# Altium schematic sheet [08]-PumpDriverUnit.SchDoc: RS232 and RS422/RS485 (part 1 of 3)
size A3; Organization: Toradex AG; Address1: Altsagenstrasse 5; Address2: Horw; Address3: 6048; Address4: Switzerland; DocumentNumber: 8; Revision: V3.2; SheetNumber: 8; SheetTotal: 26; PageSetup: Record=PageOptions|CenterHorizontal=True|CenterVertical=True|PrintScale=0.73|XCorrection=1.00|YCorrection=1.00|PrintKind=0|BorderSize=5000000|LeftOffset=0|BottomOffset=0|Orientation=2|PaperLength=1000|PaperWidth=1000|Scale=100|PaperSource=7|PrintQuality=-4|MediaType=1|DitherType=10|PaperKind=A4|PrintScaleMode=1
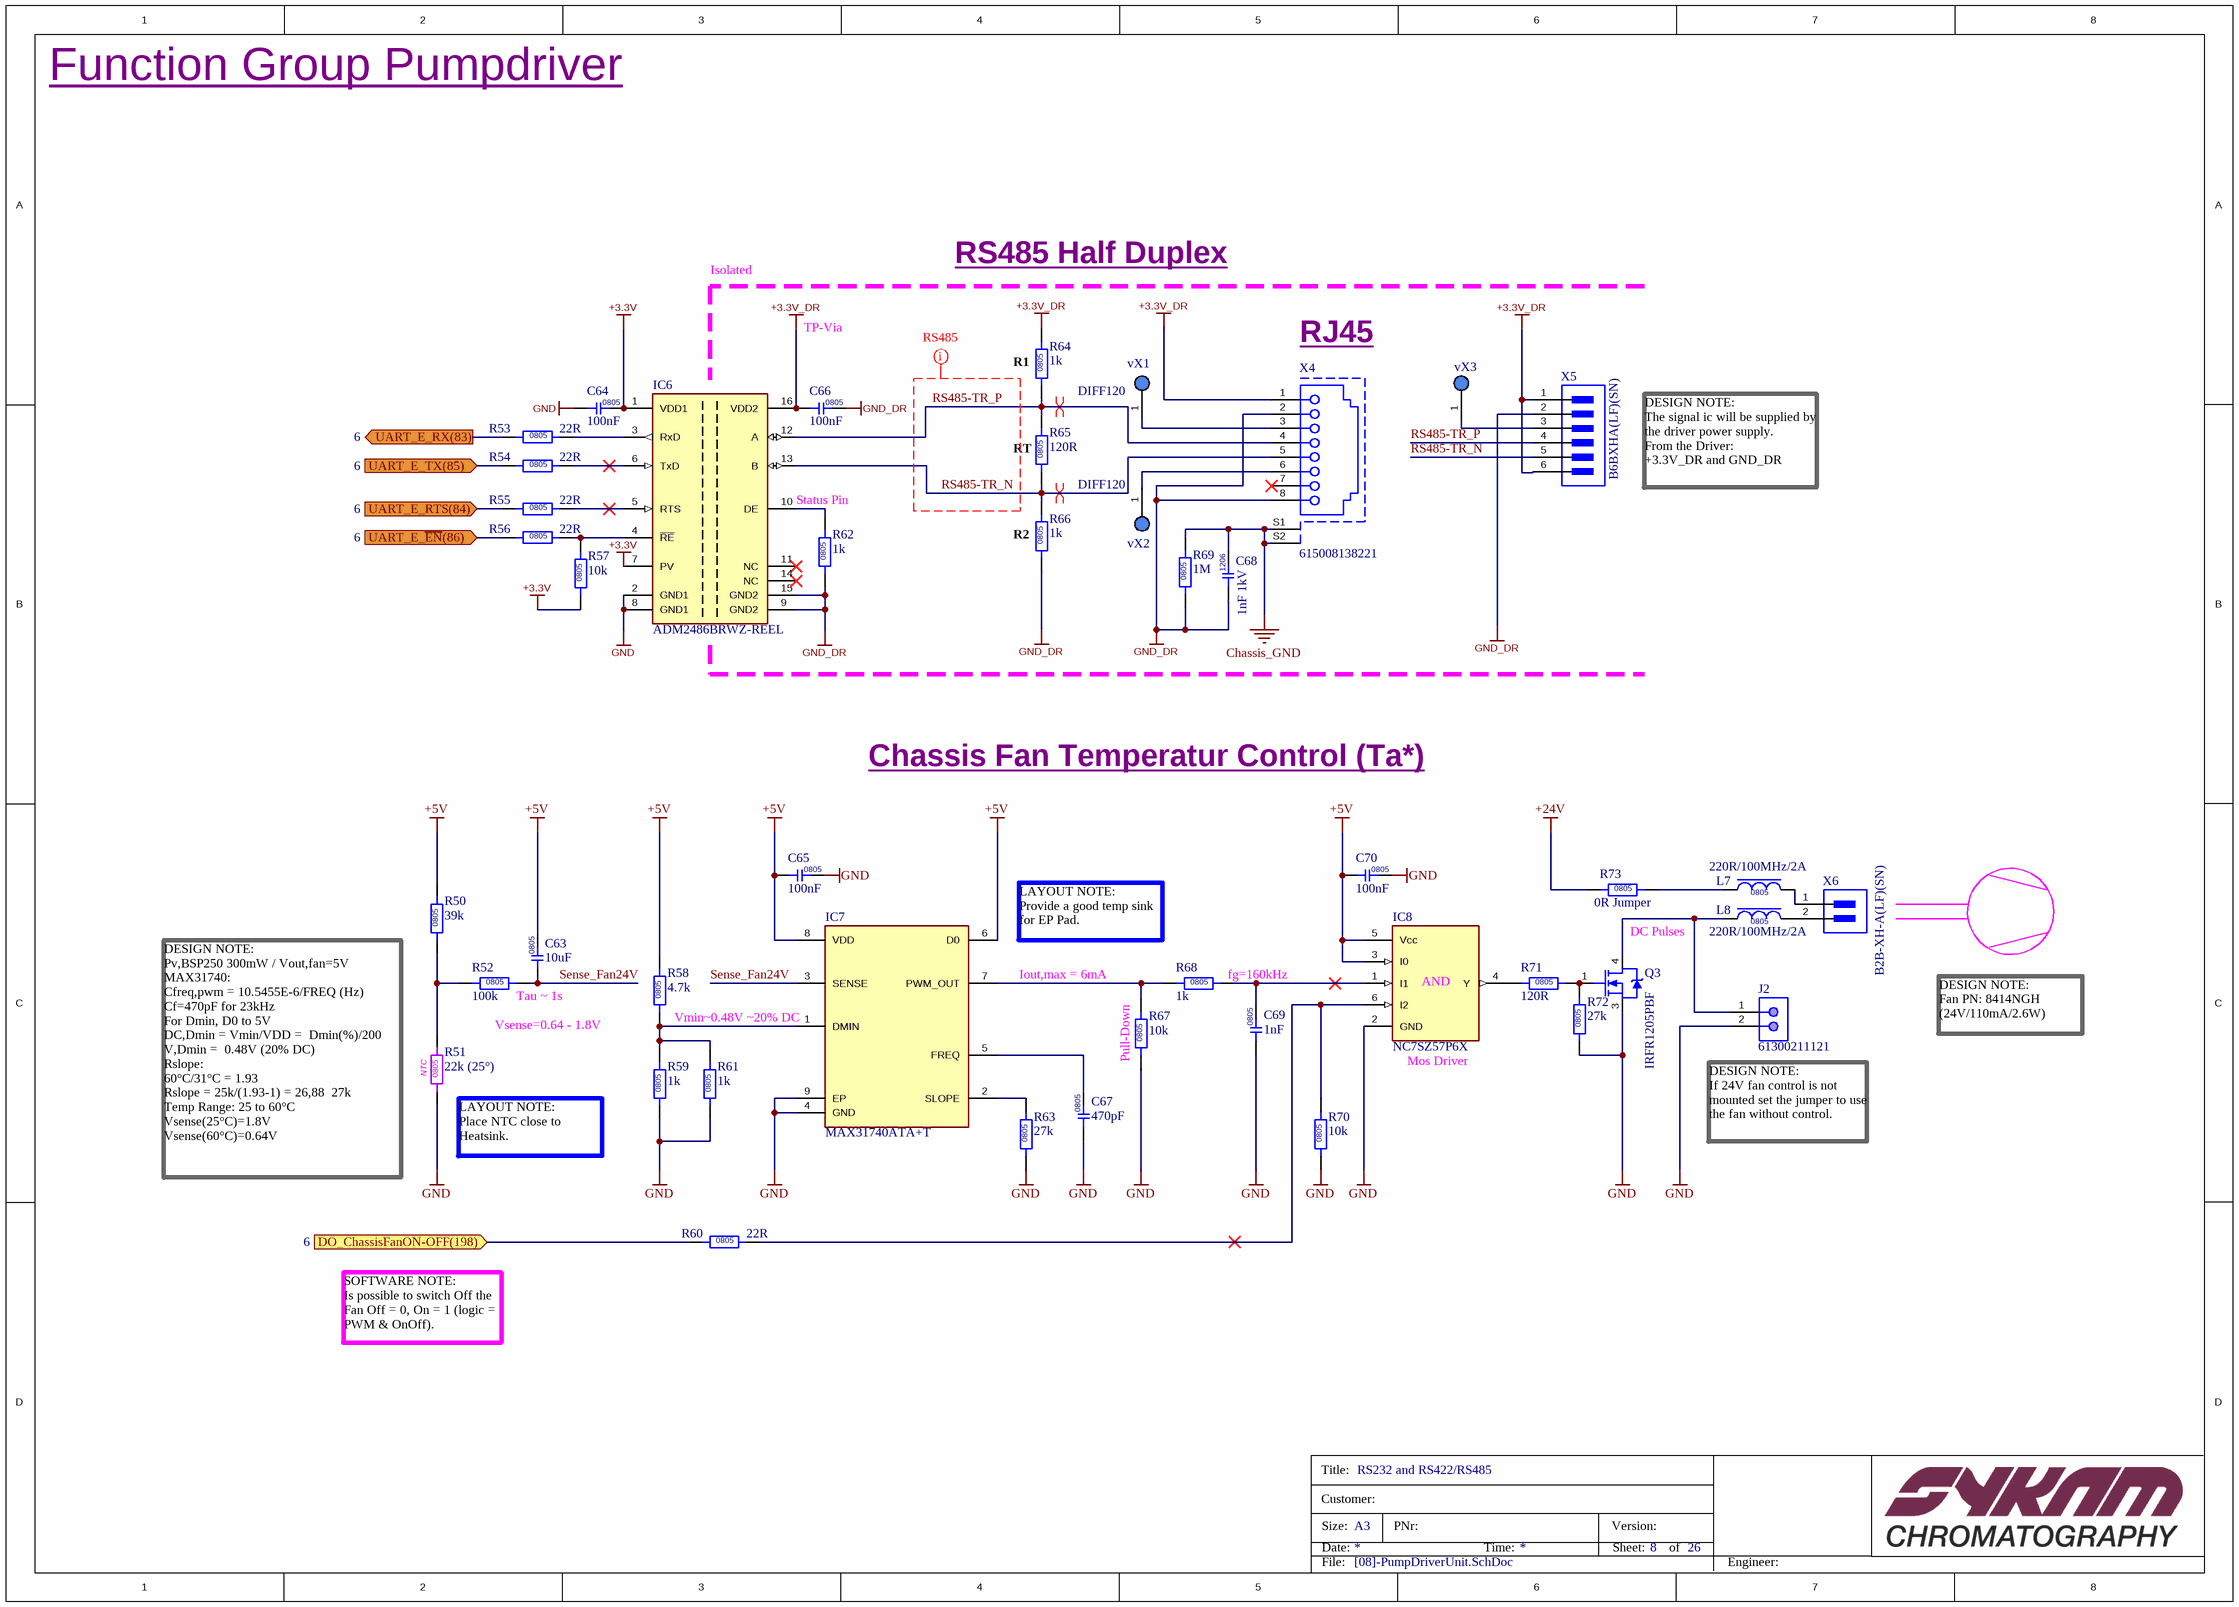
[diagram p0: [08]-PumpDriverUnit.SchDoc]

## Parts
C63  10uF  [C0805]
C64  100nF  [C0805]
C65  100nF  [C0805]
C66  100nF  [C0805]
C67  470pF  [C0805]
C68  1nF 1kV  [C1206]
C69  1nF  [C0805]
C70  100nF  [C0805]
IC6  ADM2486BRWZ-REEL  [ADM2486_SOIC16W]
IC7  MAX31740ATA+T  [TDFN-MN8]
IC8  NC7SZ57P6X  [NC7SZ57P6X]
J2  61300211121  [CON-61300211121_Jumper-2p]
L7  220R/100MHz/2A  [L0805]
L8  220R/100MHz/2A  [L0805]
Q3  IRFR1205PBF  [NMOS-TO-252AA-3_M]
R50  39k  [R0805]
R51  22k (25°)  [R_NTC-PTC-0805]
R52  100k  [R0805]
R53  22R  [R0805]
R54  22R  [R0805]
R55  22R  [R0805]
R56  22R  [R0805]
R57  10k  [R0805]
R58  4.7k  [R0805]
R59  1k  [R0805]
R60  22R  [R0805]
R61  1k  [R0805]
R62  1k  [R0805]
R63  27k  [R0805]
R64  1k  [R0805]
R65  120R  [R0805]
R66  1k  [R0805]
R67  10k  [R0805]
R68  1k  [R0805]
R69  1M  [R0805]
R70  10k  [R0805]
R71  120R  [R0805]
R72  27k  [R0805]
R73  0R Jumper  [R0805]
vX1  Reserve Contact Via 0.5mm  [ReseveContact]  (value not drawn)  (no BOM)
vX2  Reserve Contact Via 0.5mm  [ReseveContact]  (value not drawn)  (no BOM)
vX3  Reserve Contact Via 0.5mm  [ReseveContact]  (value not drawn)  (no BOM)
X4  615008138221  [RJ45-V-615008138221]
X5  B6BXHA(LF)(SN)  [B6BXHA(LF)(SN)]
X6  B2B-XH-A(LF)(SN)  [CON_2p_JST-B2B-XH-A_V]

## Ports
DO_ChassisFanON-OFF(198) (in, see 6), UART_E_RTS(84) (in, see 6), UART_E_RX(83) (out, see 6), UART_E_TX(85) (in, see 6), UART_E_~{EN}(86) (in, see 6)

## Nets
+3.3V: C64.2 IC6.1(VDD1) IC6.7(PV) R57.1
+3.3V_DR: C66.1 IC6.16(VDD2) R64.2 X4.1 X5.1 X5.6
+5V: C63.2 C65.1 C70.1 IC7.6(D0) IC7.8(VDD) IC8.3(I0) IC8.5(Vcc) R50.2 R58.2
+24V: R73.1
Chassis_GND: C68.2 R69.2 X4.S1 X4.S2
GND: C64.1 C65.2 C67.1 C69.1 C70.2 IC6.2(GND1) IC6.8(GND1) IC7.4(GND) IC7.9(EP) IC8.2(GND) J2.2 Q3.3(S) R51.1 R59.1 R61.1 R63.1 R67.1 R70.1 R72.1
GND_DR: C66.2 C68.1 IC6.9(GND2) IC6.15(GND2) R62.1 R66.1 R69.1 X4.2 X4.8 X5.2
DO_ChassisFanON-OFF(198): R60.1 ; port DO_ChassisFanON-OFF(198)
RS485-TR_N: IC6.13(B) R65.1 R66.2 X4.5 X5.5
RS485-TR_P: IC6.12(A) R64.1 R65.2 X4.4 X5.4
Sense_Fan24V: C63.1 IC7.3(SENSE) R52.2
UART_E_~{EN}(86): R56.1 ; port UART_E_~{EN}(86)
UART_E_RTS(84): R55.1 ; port UART_E_RTS(84)
UART_E_RX(83): R53.1 ; port UART_E_RX(83)
UART_E_TX(85): R54.1 ; port UART_E_TX(85)
NetC67_2: C67.2 IC7.5(FREQ)
NetC69_2: C69.2 IC8.1(I1) R68.2
NetIC6_3: IC6.3(RxD) R53.2
NetIC6_4: IC6.4(~{RE}) R56.2 R57.2
NetIC6_5: IC6.5(RTS) R55.2
NetIC6_6: IC6.6(TxD) R54.2
NetIC6_10: IC6.10(DE) R62.2
NetIC7_1: IC7.1(DMIN) R58.1 R59.2 R61.2
NetIC7_2: IC7.2(SLOPE) R63.2
NetIC7_7: IC7.7(PWM_OUT) R67.2 R68.1
NetIC8_4: IC8.4(Y) R71.1
NetIC8_6: IC8.6(I2) R60.2 R70.2
NetJ2_1: J2.1 L8.1 Q3.4(D)
NetL7_1: L7.1 R73.2
NetL7_2: L7.2 X6.1
NetL8_2: L8.2 X6.2
NetQ3_1: Q3.1(G) R71.2 R72.2
NetR50_1: R50.1 R51.2 R52.1
NetvX1_1: vX1.1 X4.3
NetvX2_1: vX2.1 X4.6
NetvX3_1: vX3.1 X5.3

Not connected (* = marked no-connect by the designer): IC6 11(NC)* 14(NC)*; X4 7*

## Layout directives
differential pair; differential pair class Diff-RS485_HD; RS485: DIFF120: RS485-TR_N, RS485-TR_P
net class RS485_HD: RS485-TR_N, RS485-TR_P

## Notes on the sheet
- Function Group Pumpdriver
- Isolated
- TP-Via
- RS485 Half Duplex
- (near R64) R1
- (near X4) RJ45
- (near R65) RT
- DESIGN NOTE:
  The signal ic will be supplied by the driver power supply.
  From the Driver:
  +3.3V_DR and GND_DR
- Status Pin
- (near R66) R2
- Chassis Fan Temperatur Control (Ta*)
- Iout,max = 6mA
- LAYOUT NOTE:
  Provide a good temp sink for EP Pad.
- (near R68) fg=160kHz
- DC Pulses
- Vsense=0.64 - 1.8V
- (near R52) Tau ~ 1s
- (near R58) Vmin~0.48V ~20% DC
- (near R67) Pull-Down
- (near IC8) AND
- DESIGN NOTE:
  Fan PN: 8414NGH (24V/110mA/2.6W)
- (near IC8) Mos Driver
- DESIGN NOTE:
  Pv,BSP250 300mW / Vout,fan=5V
  MAX31740:
  Cfreq,pwm = 10.5455E-6/FREQ (Hz)
  Cf=470pF for 23kHz
  For Dmin, D0 to 5V
  DC,Dmin = Vmin/VDD =  Dmin(%)/200
  V,Dmin =  0.48V (20% DC)
  Rslope:
  60°C/31°C = 1.93
  Rslope = 25k/(1.93-1) = 26,88  27k
  Temp Range: 25 to 60°C
  Vsense(25°C)=1.8V
  Vsense(60°C)=0.64V
- (near R51) LAYOUT NOTE:
  Place NTC close to Heatsink.
- (near J2) DESIGN NOTE:
  If 24V fan control is not mounted set the jumper to use the fan without control.
- SOFTWARE NOTE:
  Is possible to switch Off the Fan Off = 0, On = 1 (logic = PWM & OnOff).
- Title:
- Customer:
- Size:
- Date:
- A3
- PNr:
- Time:
- Version:
- Sheet:
- of
- File:
- Engineer:
- Title
- Number:
- Revision:
- Sheet
- (in symbol R_NTC_22k_B57471V2223J062) NTC